# Altium schematic sheet 5 gate driver.SchDoc
size A4; SheetNumber: 5; SheetTotal: 6
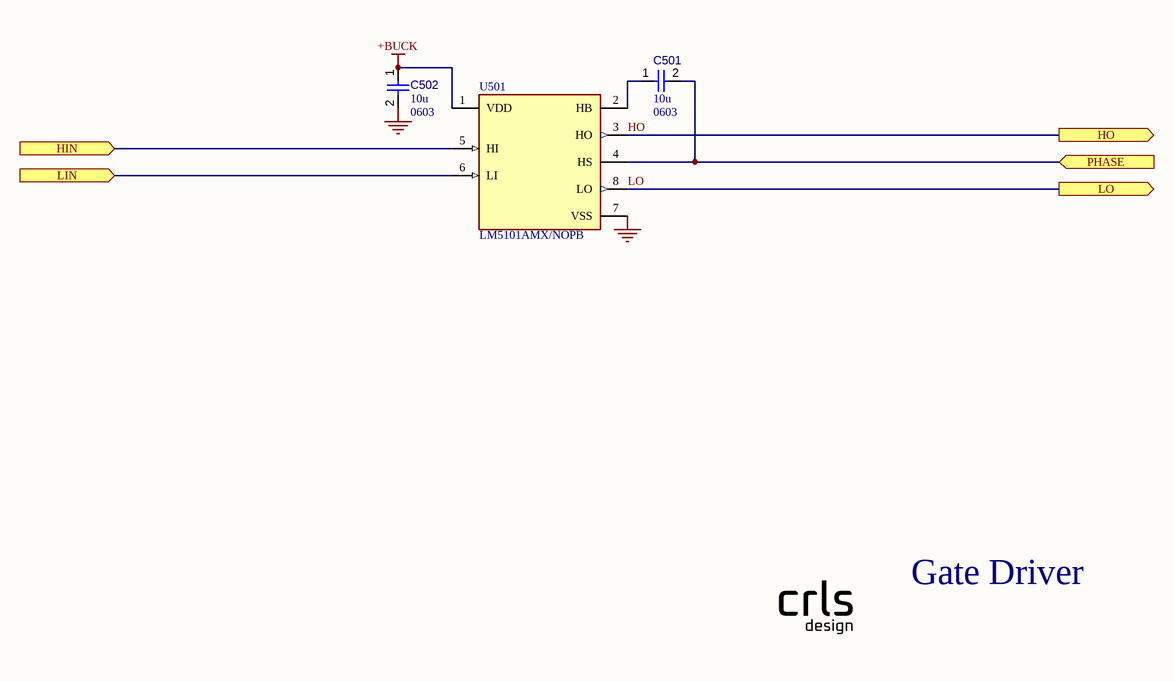
[diagram p0: 5 gate driver.SchDoc]

## Parts
C501  value 10u  Case/Package: 0603  [CAPC0603(1608)100_L]  (hidden comment: Capacitors,ceramic,0603,20%,10u,25V)
C502  value 10u  Case/Package: 0603  [CAPC0603(1608)100_L]  (hidden comment: Capacitors,ceramic,0603,20%,10u,25V)
U501  LM5101AMX/NOPB  [FP-D0008A-MFG]

## Ports
HIN (in), HO (out), LIN (in), LO (out), PHASE (in)

## Nets
+BUCK: C502.1 U501.1(VDD)
GND: C502.2 U501.7(VSS)
HIN: U501.5(HI) ; port HIN
HO: U501.3(HO) ; port HO
LIN: U501.6(LI) ; port LIN
LO: U501.8(LO) ; port LO
PHASE: C501.2 U501.4(HS) ; port PHASE
NetC501_1: C501.1 U501.2(HB)

## Notes on the sheet
- Gate Driver

## Library data of the parts
C501 C502 = Capacitors: Capacitor; Capacitor Type: ceramic; Voltage Rating: 25V; Tolerance: 20%; Component Type: Capacitors
U501 = CMP-04912-000094-1: IC GATE DRVR HALF-BRIDGE 8SOIC; Supply Current: 2mA; Number of Channels: 2; Turn-Off Delay Time: 4ns; Min Supply Voltage: 9V; Max Supply Voltage: 14V; Rise Time: 430ns; Propagation Delay: 26ns; Max Output Current: 3A; Quiescent Current: 200uA; Fall Time: 260ns; Series: LM5101A; Number of Outputs: 2; Mount: Surface Mount; RoHS Compliant: Yes; Nominal Supply Current: 2mA; Case/Package: SOIC; Number of Pins: 8; Number of Drivers: 2; Lead Free: Lead Free; Max Operating Temperature: 125°C; Output Current: 3A; Package Quantity: 2500; Radiation Hardening: No; Min Operating Temperature: -40°C; Packaging: Tape and Reel; Turn-On Delay Time: 4ns